# Altium schematic sheet Interface.SchDoc
size A4
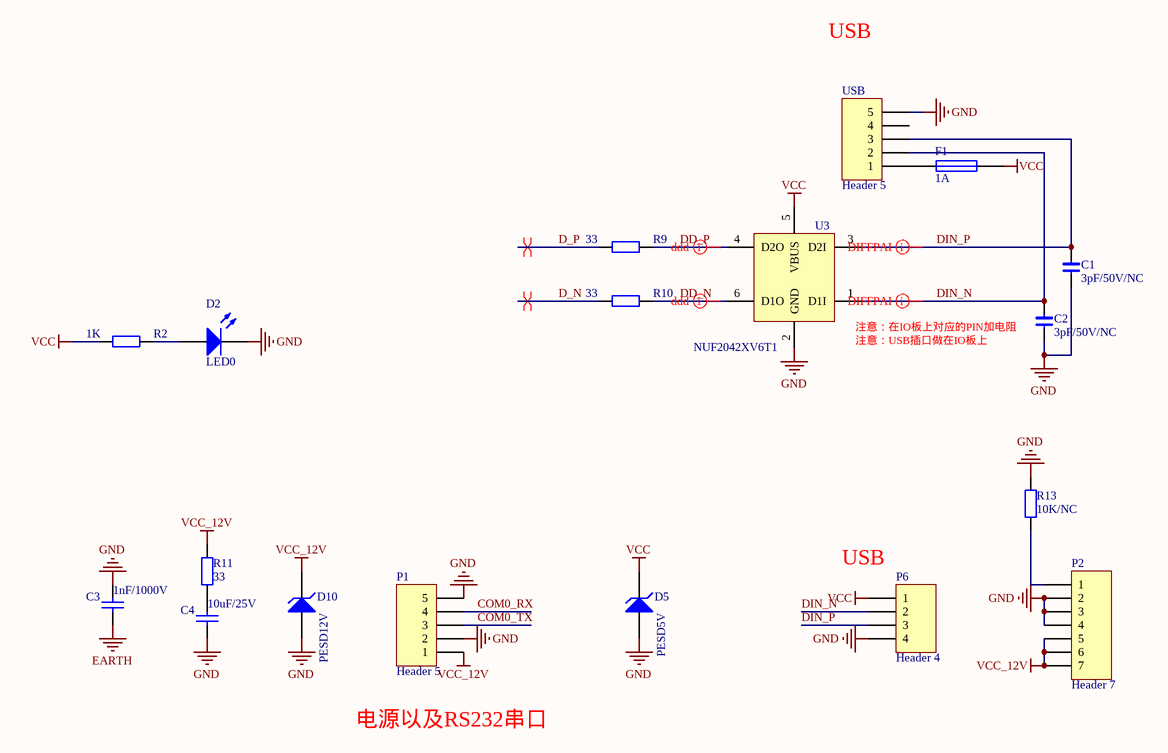
[diagram p0: Interface.SchDoc]

## Parts
C1  3pF/50V/NC  [0402C]
C2  3pF/50V/NC  [0402C]
C3  1nF/1000V  [1206C]
C4  10uF/25V  [0603C]
D2  LED0  [0603LED]
D5  PESD5V  [SOD323]
D10  PESD12V  [SOD323]
F1  1A  [0805R]
P1  Header 5  [KF350-5P]
P2  Header 7  [7×1.25mmSMT]
P6  Header 4  [4×1.25mmSMT]
R2  1K  [0402R]
R9  33  [0402R]
R10  33  [0402R]
R11  33  [0402R]
R13  10K/NC  [0402R]
U3  NUF2042XV6T1  [SOT563-6]
USB  Header 5  [Micro_USB_PH]

## Nets
EARTH: C3.1
GND: C1.2 C2.2 C3.2 C4.1 D2.2(K) D5.A D10.A P1.2 P1.5 P2.2 P2.3 P2.4 P6.4 R13.1 U3.2(GND) USB.5
VCC: D5.K F1.2 P6.1 R2.1 U3.5(VBUS)
VCC_12V: D10.K P1.1 P2.5 P2.6 P2.7 R11.2
COM0_RX: P1.4
COM0_TX: P1.3
D_N: R10.1
D_P: R9.1
DD_N: R10.2 U3.6(D1O)
DD_P: R9.2 U3.4(D2O)
DIN_N: C2.1 P6.2 U3.1(D1I) USB.2
DIN_P: C1.1 P6.3 U3.3(D2I) USB.3
NetC4_2: C4.2 R11.1
NetD2_1: D2.1(A) R2.2
NetF1_1: F1.1 USB.1
NetP2_1: P2.1 R13.2

Not connected (* = marked no-connect by the designer): USB 4

## Layout directives
differential pair: D_N, D_P, DD_N, DD_P, DIN_N, DIN_P

## Notes on the sheet
- USB
- (near U3) 注意：在IO板上对应的PIN加电阻
- (near U3) 注意：USB插口做在IO板上
- (near P6) USB
- 电源以及RS232串口

## Library data of the parts
C1 C2 = C
C3 C4 = Cap: Capacitor; Value: 106/50V; Published: 8-Jun-2000; LatestRevisionDate: 17-Jul-2002; LatestRevisionNote: Re-released for DXP Platform.; PackageReference: RAD-0.3; Publisher: Altium Limited
D2 = LED0: Typical INFRARED GaAs LED; Published: 8-Jun-2000; LatestRevisionDate: 08-Jul-2005; LatestRevisionNote: Mech Layer 1 removed.; PackageReference: LED-0; Publisher: Altium Limited
D5 D10 = D Zener: Zener Diode; Published: 8-Jun-2000; LatestRevisionDate: 17-Jul-2002; LatestRevisionNote: Re-released for DXP Platform.; PackageReference: DIODE-0.7; Publisher: Altium Limited
F1 = Fuse 1: Fuse; Published: 8-Jun-2000; LatestRevisionDate: 17-Jul-2002; LatestRevisionNote: Re-released for DXP Platform.; PackageReference: PIN-W2/E2.8; Publisher: Altium Limited
P1 USB = Header 5: Header, 5-Pin; LatestRevisionDate: 17-Jul-2002; LatestRevisionNote: Re-released for DXP Platform.; Publisher: Altium Limited
P2 = Header 7: Header, 7-Pin; LatestRevisionDate: 17-Jul-2002; LatestRevisionNote: Re-released for DXP Platform.; Publisher: Altium Limited
P6 = Header 4: Header, 4-Pin; LatestRevisionDate: 17-Jul-2002; LatestRevisionNote: Re-released for DXP Platform.; Publisher: Altium Limited
R2 R9-R11 R13 = Resistor: Resistor SMD - IEC symbol version; Value: NC; LatestRevisionDate: 27-Jul-20  -  Semtech